# Altium schematic sheet msp430Sheet.SchDoc
size A4
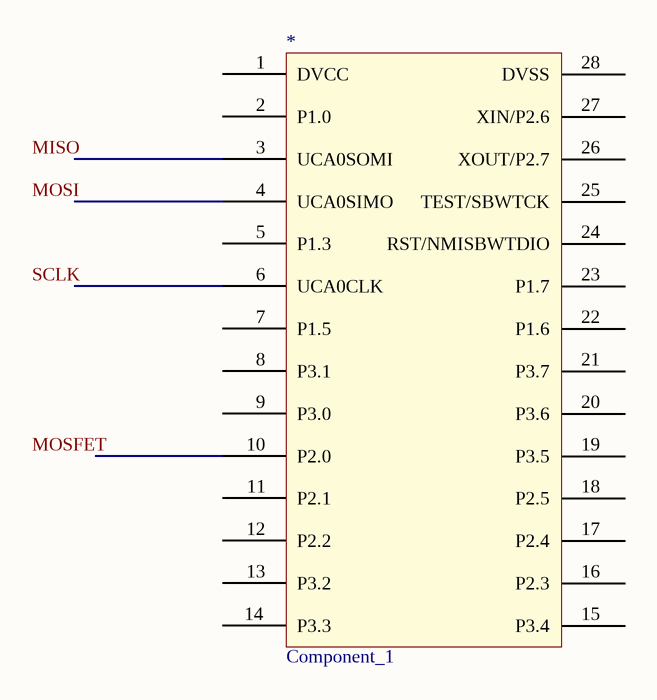
[diagram p0: msp430Sheet.SchDoc]

## Parts
*  Component_1

## Nets

Not connected (* = marked no-connect by the designer): * 1(DVCC) 2(P1.0) 3(UCA0SOMI) 4(UCA0SIMO) 5(P1.3) 6(UCA0CLK) 7(P1.5) 8(P3.1) 9(P3.0) 10(P2.0) 11(P2.1) 12(P2.2) 13(P3.2) 14(P3.3) 15(P3.4) 16(P2.3) 17(P2.4) 18(P2.5) 19(P3.5) 20(P3.6) 21(P3.7) 22(P1.6) 23(P1.7) 24(RST/NMISBWTDIO) 25(TEST/SBWTCK) 26(XOUT/P2.7) 27(XIN/P2.6) 28(DVSS)

## Notes on the sheet
- Labels drawn without touching a wire or pin: MISO, MOSFET, MOSI, SCLK